# EAGLE schematic schematics (EAGLE 9.2.0)
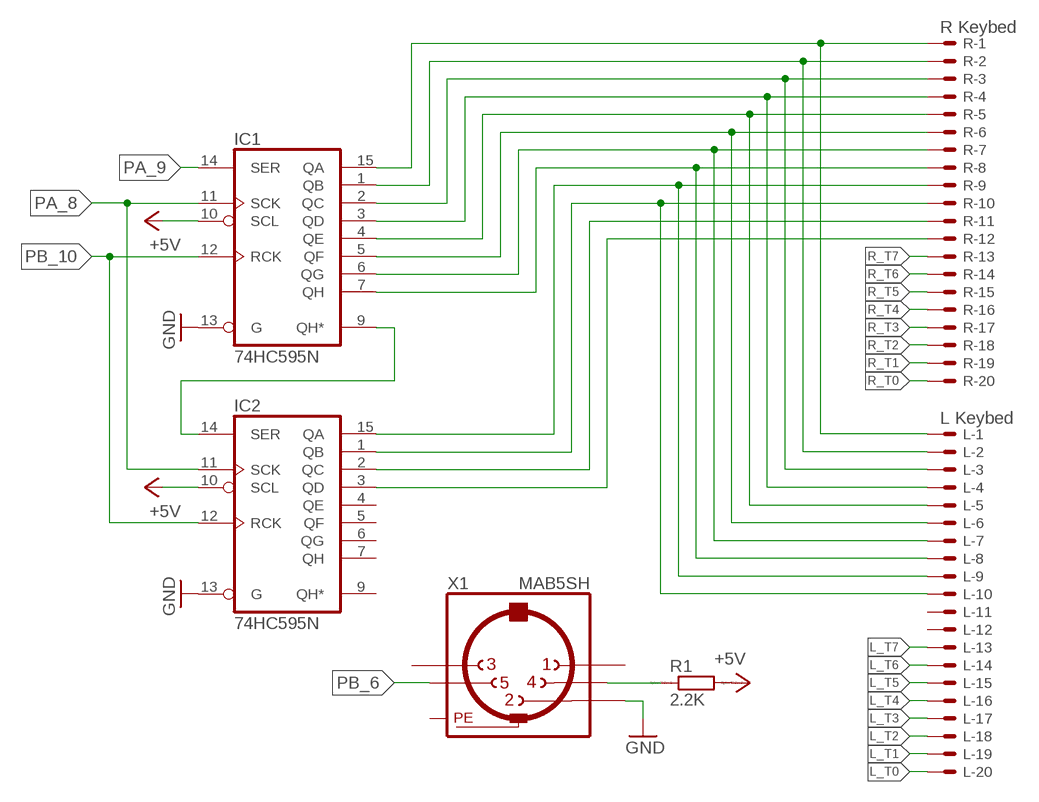
[diagram p0: schematic, sheet 1]

## Parts
IC1  74HC595N  [DIL16]
IC2  74HC595N  [DIL16]
L  L Keybed  5566-20  [5566-20]
R  R Keybed  5566-20  [5566-20]
R1  2.2K  R0207/10  [0207/10]
X1  MAB5SH  [MAB5SH]

## Nets
+5V: IC1.10(SCL) IC2.10(SCL) R1.2
GND: IC1.13(G) IC2.13(G) X1.2
L_T0: L.20
L_T1: L.19
L_T2: L.18
L_T3: L.17
L_T4: L.16
L_T5: L.15
L_T6: L.14
L_T7: L.13
N$1: IC1.15(QA) L.1 R.1
N$2: IC1.1(QB) L.2 R.2
N$3: IC1.2(QC) L.3 R.3
N$4: IC1.3(QD) L.4 R.4
N$5: IC1.4(QE) L.5 R.5
N$6: IC1.5(QF) L.6 R.6
N$7: IC1.6(QG) L.7 R.7
N$8: IC1.7(QH) L.8 R.8
N$9: IC2.15(QA) L.9 R.9
N$10: IC2.1(QB) L.10 R.10
N$11: IC2.2(QC) R.11
N$12: IC2.3(QD) R.12
N$13: IC1.9(QH*) IC2.14(SER)
N$14: R1.1 X1.4
PA_8: IC1.12(RCK) IC2.12(RCK)
PA_9: IC1.14(SER)
PB_6: X1.5
PB_10: IC1.11(SCK) IC2.11(SCK)
R_T0: R.20
R_T1: R.19
R_T2: R.18
R_T3: R.17
R_T4: R.16
R_T5: R.15
R_T6: R.14
R_T7: R.13
Unconnected: IC2.4(QE) IC2.5(QF) IC2.6(QG) IC2.7(QH) IC2.9(QH*) L.11 L.12 X1.1 X1.3

## Power pins joined to a net without a drawn wire
GND: IC1.8(GND) IC2.8(GND)
PE: X1.PE X1.PE@(PE)
VCC: IC1.16(VCC) IC2.16(VCC)

## Library data of the parts
IC1 IC2 = 74xx-eu:74*595: 8-bit SHIFT REGISTER, output latch
L R = con-molex:5566-20: Mini FIT connector 20 pol ATX PC-Motherboard Power connector Source: http://www.molex.com; MF: MOLEX; OC_FARNELL: unknown; OC_NEWARK: unknown
R1 = eagle-ltspice:R: RESISTOR, European symbol; SPICEMODEL: NONE; SPICEPREFIX: R
X1 = con-hirschmann:MAB5SH: Female CONNECTOR 5 pins 90 deg. with shield, horizontal (DIN 41524); OC_FARNELL: 809883; OC_NEWARK: unknown